# Altium schematic sheet RK3566.SchDoc
size A3; SheetNumber: 14; SheetTotal: 20
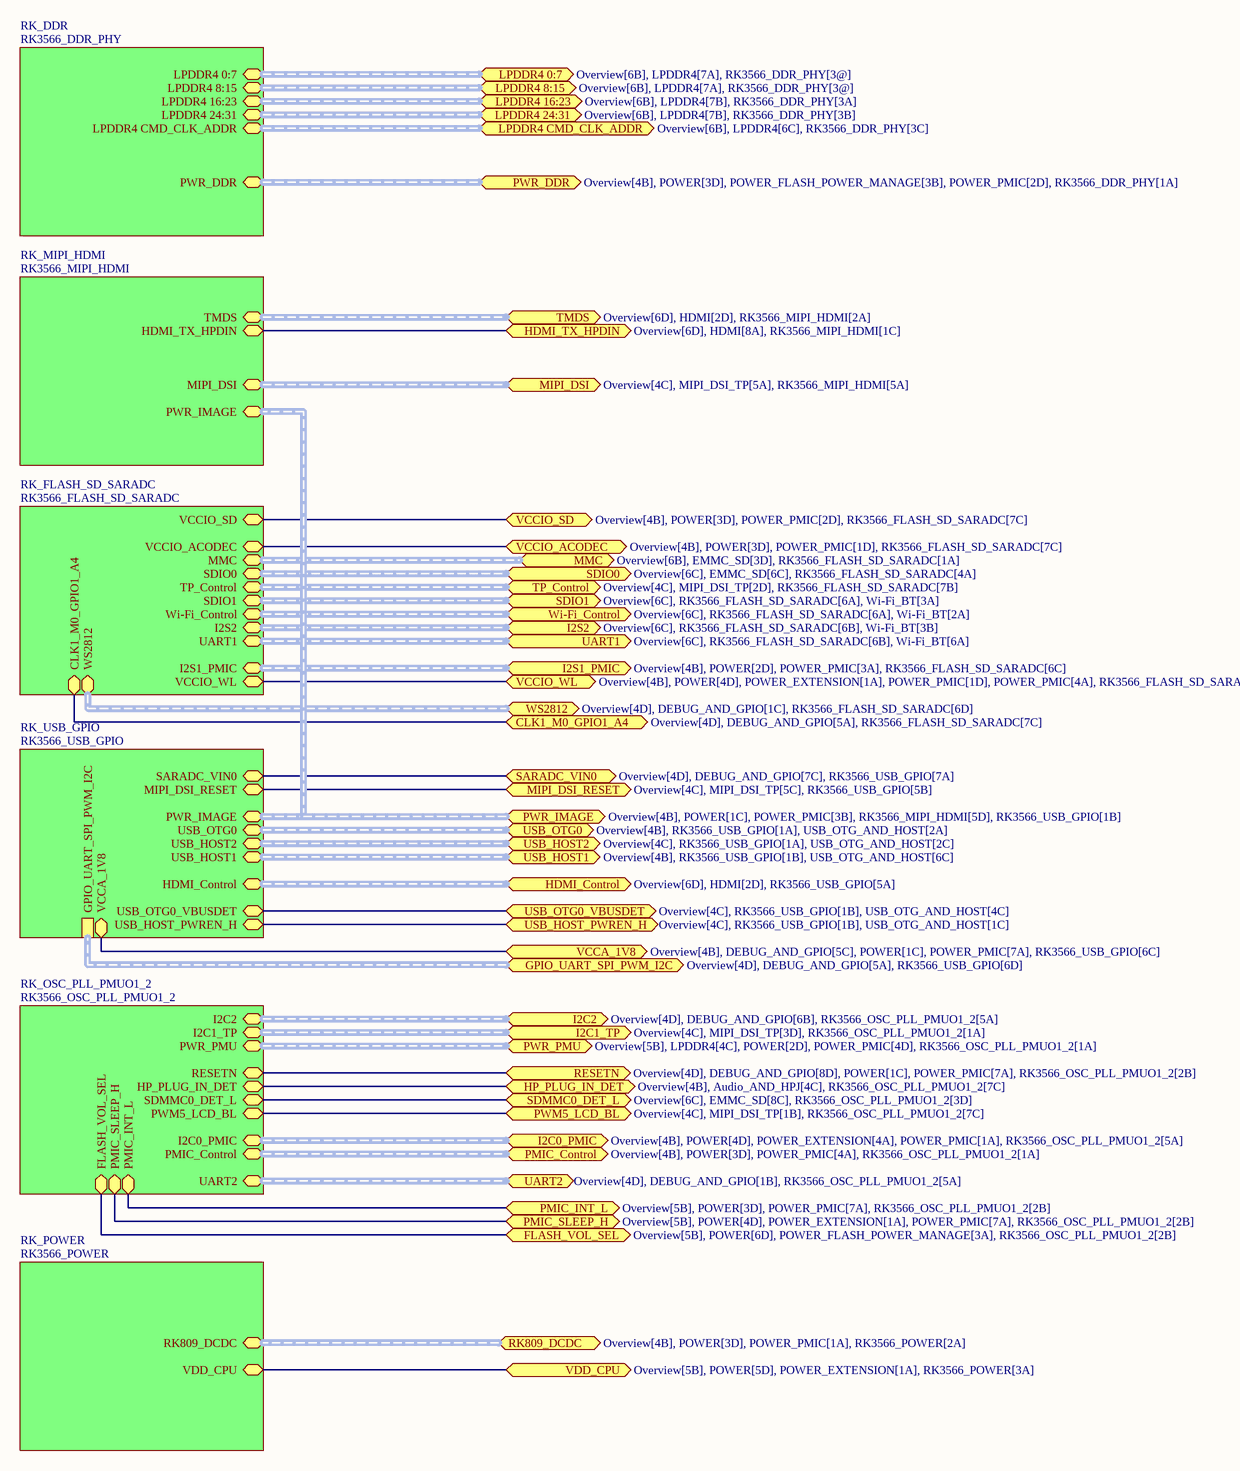
[diagram p0: RK3566.SchDoc]

## Sub-sheets
RK_DDR = RK3566_DDR_PHY: LPDDR4 0:7 (bidir), LPDDR4 8:15 (bidir), LPDDR4 16:23 (bidir), LPDDR4 24:31 (bidir), LPDDR4 CMD_CLK_ADDR (bidir), PWR_DDR (bidir)
RK_FLASH_SD_SARADC = RK3566_FLASH_SD_SARADC: MMC (bidir), SDIO0 (bidir), SDIO1 (bidir), Wi-Fi_Control (bidir), I2S2 (bidir), UART1 (bidir), TP_Control (bidir), I2S1_PMIC (bidir), VCCIO_SD (bidir), VCCIO_ACODEC (bidir), VCCIO_WL (bidir), CLK1_M0_GPIO1_A4 (bidir), WS2812 (bidir)
RK_MIPI_HDMI = RK3566_MIPI_HDMI: TMDS (bidir), MIPI_DSI (bidir), HDMI_TX_HPDIN (bidir), PWR_IMAGE (bidir)
RK_OSC_PLL_PMUO1_2 = RK3566_OSC_PLL_PMUO1_2: I2C1_TP (bidir), PWM5_LCD_BL (bidir), SDMMC0_DET_L (bidir), PMIC_Control (bidir), I2C0_PMIC (bidir), UART2 (bidir), HP_PLUG_IN_DET (bidir), PWR_PMU (bidir), PMIC_INT_L (bidir), PMIC_SLEEP_H (bidir), FLASH_VOL_SEL (bidir), RESETN (bidir), I2C2 (bidir)
RK_POWER = RK3566_POWER: RK809_DCDC (bidir), VDD_CPU (bidir)
RK_USB_GPIO = RK3566_USB_GPIO: HDMI_Control (bidir), MIPI_DSI_RESET (bidir), USB_OTG0 (bidir), USB_HOST2 (bidir), USB_OTG0_VBUSDET (bidir), USB_HOST_PWREN_H (bidir), USB_HOST1 (bidir), PWR_IMAGE (bidir), SARADC_VIN0 (bidir), VCCA_1V8 (bidir), GPIO_UART_SPI_PWM_I2C

## Ports
CLK1_M0_GPIO1_A4 (bidir, see Overview[4D], DEBUG_AND_GPIO[5A], RK3566_FLASH_SD_SARADC[7C]), FLASH_VOL_SEL (bidir, see Overview[5B], POWER[6D], POWER_FLASH_POWER_MANAGE[3A], RK3566_OSC_PLL_PMUO1_2[2B]), GPIO_UART_SPI_PWM_I2C (bidir, harness GPIO_UART_SPI_PWM_I2C, see Overview[4D], DEBUG_AND_GPIO[5A], RK3566_USB_GPIO[6D]), HDMI_Control (bidir, see Overview[6D], HDMI[2D], RK3566_USB_GPIO[5A]), HDMI_TX_HPDIN (bidir, see Overview[6D], HDMI[8A], RK3566_MIPI_HDMI[1C]), HP_PLUG_IN_DET (bidir, see Overview[4B], Audio_AND_HPJ[4C], RK3566_OSC_PLL_PMUO1_2[7C]), I2C0_PMIC (bidir, harness PMIC_Control, see Overview[4B], POWER[4D], POWER_EXTENSION[4A], POWER_PMIC[1A], RK3566_OSC_PLL_PMUO1_2[5A]), I2C1_TP (bidir, see Overview[4C], MIPI_DSI_TP[3D], RK3566_OSC_PLL_PMUO1_2[1A]), I2C2 (bidir, harness I2C2, see Overview[4D], DEBUG_AND_GPIO[6B], RK3566_OSC_PLL_PMUO1_2[5A]), I2S1_PMIC (bidir, see Overview[4B], POWER[2D], POWER_PMIC[3A], RK3566_FLASH_SD_SARADC[6C]), I2S2 (bidir, see Overview[6C], RK3566_FLASH_SD_SARADC[6B], Wi-Fi_BT[3B]), LPDDR4 0:7 (bidir, see Overview[6B], LPDDR4[7A], RK3566_DDR_PHY[3@]), LPDDR4 8:15 (bidir, see Overview[6B], LPDDR4[7A], RK3566_DDR_PHY[3@]), LPDDR4 16:23 (bidir, see Overview[6B], LPDDR4[7B], RK3566_DDR_PHY[3A]), LPDDR4 24:31 (bidir, see Overview[6B], LPDDR4[7B], RK3566_DDR_PHY[3B]), LPDDR4 CMD_CLK_ADDR (bidir, see Overview[6B], LPDDR4[6C], RK3566_DDR_PHY[3C]), MIPI_DSI (bidir, see Overview[4C], MIPI_DSI_TP[5A], RK3566_MIPI_HDMI[5A]), MIPI_DSI_RESET (bidir, see Overview[4C], MIPI_DSI_TP[5C], RK3566_USB_GPIO[5B]), MMC (bidir, see Overview[6B], EMMC_SD[3D], RK3566_FLASH_SD_SARADC[1A]), PMIC_Control (bidir, harness PMIC_Control, see Overview[4B], POWER[3D], POWER_PMIC[4A], RK3566_OSC_PLL_PMUO1_2[1A]), PMIC_INT_L (bidir, see Overview[5B], POWER[3D], POWER_PMIC[7A], RK3566_OSC_PLL_PMUO1_2[2B]), PMIC_SLEEP_H (bidir, see Overview[5B], POWER[4D], POWER_EXTENSION[1A], POWER_PMIC[7A], RK3566_OSC_PLL_PMUO1_2[2B]), PWM5_LCD_BL (bidir, see Overview[4C], MIPI_DSI_TP[1B], RK3566_OSC_PLL_PMUO1_2[7C]), PWR_DDR (bidir, harness PWR_DDR, see Overview[4B], POWER[3D], POWER_FLASH_POWER_MANAGE[3B], POWER_PMIC[2D], RK3566_DDR_PHY[1A]), PWR_IMAGE (bidir, harness PWR_IMAGE, see Overview[4B], POWER[1C], POWER_PMIC[3B], RK3566_MIPI_HDMI[5D], RK3566_USB_GPIO[1B]), PWR_PMU (bidir, harness PWR_PMU, see Overview[5B], LPDDR4[4C], POWER[2D], POWER_PMIC[4D], RK3566_OSC_PLL_PMUO1_2[1A]), RESETN (bidir, see Overview[4D], DEBUG_AND_GPIO[8D], POWER[1C], POWER_PMIC[7A], RK3566_OSC_PLL_PMUO1_2[2B]), RK809_DCDC (bidir, harness RK809_DCDC, see Overview[4B], POWER[3D], POWER_PMIC[1A], RK3566_POWER[2A]), SARADC_VIN0 (bidir, see Overview[4D], DEBUG_AND_GPIO[7C], RK3566_USB_GPIO[7A]), SDIO0 (bidir, see Overview[6C], EMMC_SD[6C], RK3566_FLASH_SD_SARADC[4A]), SDIO1 (bidir, see Overview[6C], RK3566_FLASH_SD_SARADC[6A], Wi-Fi_BT[3A]), SDMMC0_DET_L (bidir, see Overview[6C], EMMC_SD[8C], RK3566_OSC_PLL_PMUO1_2[3D]), TMDS (bidir, see Overview[6D], HDMI[2D], RK3566_MIPI_HDMI[2A]), TP_Control (bidir, see Overview[4C], MIPI_DSI_TP[2D], RK3566_FLASH_SD_SARADC[7B]), UART1 (bidir, see Overview[6C], RK3566_FLASH_SD_SARADC[6B], Wi-Fi_BT[6A]), UART2 (bidir, harness PMIC_Control, see Overview[4D], DEBUG_AND_GPIO[1B], RK3566_OSC_PLL_PMUO1_2[5A]), USB_HOST1 (bidir, harness USB_HOST2, see Overview[4B], RK3566_USB_GPIO[1B], USB_OTG_AND_HOST[6C]), USB_HOST2 (bidir, harness USB_HOST2, see Overview[4C], RK3566_USB_GPIO[1A], USB_OTG_AND_HOST[2C]), USB_HOST_PWREN_H (bidir, see Overview[4C], RK3566_USB_GPIO[1B], USB_OTG_AND_HOST[1C]), USB_OTG0 (bidir, harness USB_OTG0, see Overview[4B], RK3566_USB_GPIO[1A], USB_OTG_AND_HOST[2A]), USB_OTG0_VBUSDET (bidir, see Overview[4C], RK3566_USB_GPIO[1B], USB_OTG_AND_HOST[4C]), VCCA_1V8 (bidir, see Overview[4B], DEBUG_AND_GPIO[5C], POWER[1C], POWER_PMIC[7A], RK3566_USB_GPIO[6C]), VCCIO_ACODEC (bidir, see Overview[4B], POWER[3D], POWER_PMIC[1D], RK3566_FLASH_SD_SARADC[7C]), VCCIO_SD (bidir, see Overview[4B], POWER[3D], POWER_PMIC[2D], RK3566_FLASH_SD_SARADC[7C]), VCCIO_WL (bidir, see Overview[4B], POWER[4D], POWER_EXTENSION[1A], POWER_PMIC[1D], POWER_PMIC[4A], RK3566_FLASH_SD_SARADC[7C]), VDD_CPU (bidir, see Overview[5B], POWER[5D], POWER_EXTENSION[1A], RK3566_POWER[3A]), Wi-Fi_Control (bidir, see Overview[6C], RK3566_FLASH_SD_SARADC[6A], Wi-Fi_BT[2A]), WS2812 (bidir, harness WS2812, see Overview[4D], DEBUG_AND_GPIO[1C], RK3566_FLASH_SD_SARADC[6D])

## Nets
CLK1_M0_GPIO1_A4: port CLK1_M0_GPIO1_A4, sheet RK_FLASH_SD_SARADC/CLK1_M0_GPIO1_A4
FLASH_VOL_SEL: port FLASH_VOL_SEL, sheet RK_OSC_PLL_PMUO1_2/FLASH_VOL_SEL
HDMI_TX_HPDIN: port HDMI_TX_HPDIN, sheet RK_MIPI_HDMI/HDMI_TX_HPDIN
HP_PLUG_IN_DET: port HP_PLUG_IN_DET, sheet RK_OSC_PLL_PMUO1_2/HP_PLUG_IN_DET
MIPI_DSI_RESET: port MIPI_DSI_RESET, sheet RK_USB_GPIO/MIPI_DSI_RESET
PMIC_INT_L: port PMIC_INT_L, sheet RK_OSC_PLL_PMUO1_2/PMIC_INT_L
PMIC_SLEEP_H: port PMIC_SLEEP_H, sheet RK_OSC_PLL_PMUO1_2/PMIC_SLEEP_H
PWM5_LCD_BL: port PWM5_LCD_BL, sheet RK_OSC_PLL_PMUO1_2/PWM5_LCD_BL
RESETN: port RESETN, sheet RK_OSC_PLL_PMUO1_2/RESETN
SARADC_VIN0: port SARADC_VIN0, sheet RK_USB_GPIO/SARADC_VIN0
SDMMC0_DET_L: port SDMMC0_DET_L, sheet RK_OSC_PLL_PMUO1_2/SDMMC0_DET_L
USB_HOST_PWREN_H: port USB_HOST_PWREN_H, sheet RK_USB_GPIO/USB_HOST_PWREN_H
USB_OTG0_VBUSDET: port USB_OTG0_VBUSDET, sheet RK_USB_GPIO/USB_OTG0_VBUSDET
VCCA_1V8: port VCCA_1V8, sheet RK_USB_GPIO/VCCA_1V8
VCCIO_ACODEC: port VCCIO_ACODEC, sheet RK_FLASH_SD_SARADC/VCCIO_ACODEC
VCCIO_SD: port VCCIO_SD, sheet RK_FLASH_SD_SARADC/VCCIO_SD
VCCIO_WL: port VCCIO_WL, sheet RK_FLASH_SD_SARADC/VCCIO_WL
VDD_CPU: port VDD_CPU, sheet RK_POWER/VDD_CPU

## Buses and harness runs
harness port GPIO_UART_SPI_PWM_I2C = sheet RK_USB_GPIO/GPIO_UART_SPI_PWM_I2C
harness port HDMI_Control = sheet RK_USB_GPIO/HDMI_Control
harness port I2C0_PMIC = sheet RK_OSC_PLL_PMUO1_2/I2C0_PMIC
harness port I2C1_TP = sheet RK_OSC_PLL_PMUO1_2/I2C1_TP
harness port I2C2 = sheet RK_OSC_PLL_PMUO1_2/I2C2
harness port I2S1_PMIC = sheet RK_FLASH_SD_SARADC/I2S1_PMIC
harness port I2S2 = sheet RK_FLASH_SD_SARADC/I2S2
harness port LPDDR4 0:7 = sheet RK_DDR/LPDDR4 0:7
harness port LPDDR4 8:15 = sheet RK_DDR/LPDDR4 8:15
harness port LPDDR4 16:23 = sheet RK_DDR/LPDDR4 16:23
harness port LPDDR4 24:31 = sheet RK_DDR/LPDDR4 24:31
harness port LPDDR4 CMD_CLK_ADDR = sheet RK_DDR/LPDDR4 CMD_CLK_ADDR
harness port MIPI_DSI = sheet RK_MIPI_HDMI/MIPI_DSI
harness port MMC = sheet RK_FLASH_SD_SARADC/MMC
harness port PMIC_Control = sheet RK_OSC_PLL_PMUO1_2/PMIC_Control
harness port PWR_DDR = sheet RK_DDR/PWR_DDR
harness port PWR_IMAGE = sheet RK_MIPI_HDMI/PWR_IMAGE = sheet RK_USB_GPIO/PWR_IMAGE
harness port PWR_PMU = sheet RK_OSC_PLL_PMUO1_2/PWR_PMU
harness port RK809_DCDC = sheet RK_POWER/RK809_DCDC
harness port SDIO0 = sheet RK_FLASH_SD_SARADC/SDIO0
harness port SDIO1 = sheet RK_FLASH_SD_SARADC/SDIO1
harness port TMDS = sheet RK_MIPI_HDMI/TMDS
harness port TP_Control = sheet RK_FLASH_SD_SARADC/TP_Control
harness port UART1 = sheet RK_FLASH_SD_SARADC/UART1
harness port UART2 = sheet RK_OSC_PLL_PMUO1_2/UART2
harness port USB_HOST1 = sheet RK_USB_GPIO/USB_HOST1
harness port USB_HOST2 = sheet RK_USB_GPIO/USB_HOST2
harness port USB_OTG0 = sheet RK_USB_GPIO/USB_OTG0
harness port Wi-Fi_Control = sheet RK_FLASH_SD_SARADC/Wi-Fi_Control
harness port WS2812 = sheet RK_FLASH_SD_SARADC/WS2812